# EAGLE design Wheatstone (EAGLE 9.6.2)
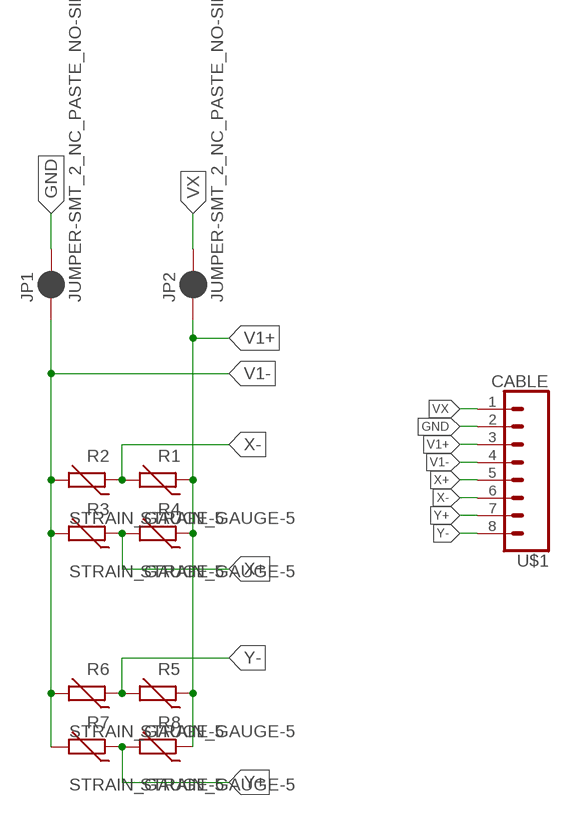
[diagram p0: schematic, sheet 1]

## Parts
JP1  JUMPER-SMT_2_NC_PASTE_NO-SILK  [SMT-JUMPER_2_NC_PASTE_NO-SILK]
JP2  JUMPER-SMT_2_NC_PASTE_NO-SILK  [SMT-JUMPER_2_NC_PASTE_NO-SILK]
R1  STRAIN_GAUGE-5  [STRAIN_GAUGE]
R2  STRAIN_GAUGE-5  [STRAIN_GAUGE]
R3  STRAIN_GAUGE-5  [STRAIN_GAUGE]
R4  STRAIN_GAUGE-5  [STRAIN_GAUGE]
R5  STRAIN_GAUGE-5  [STRAIN_GAUGE]
R6  STRAIN_GAUGE-5  [STRAIN_GAUGE]
R7  STRAIN_GAUGE-5  [STRAIN_GAUGE]
R8  STRAIN_GAUGE-5  [STRAIN_GAUGE]
U$1  CABLE  [CABLE]

## Nets
GND: JP1.2 U$1.2
V1+: JP2.1 R1.1 R4.1 R5.1 R8.1 U$1.3
V1-: JP1.1 R2.2 R3.2 R6.2 R7.2 U$1.4
VX: JP2.2 U$1.1
X+: R3.1 R4.2 U$1.5
X-: R1.2 R2.1 U$1.6
Y+: R7.1 R8.2 U$1.7
Y-: R5.2 R6.1 U$1.8

## Library data of the parts
JP1 JP2 = SparkFun-Jumpers:JUMPER-SMT_2_NC_PASTE: Normally closed solder jumper This jumper has an aperture in the stencil to allow solder paste to bridge the split in the wire so it's normally closed (NC). Wick off the solder to open the connection. Reapply solder to reclose the connection.
R1-R8 = Wheatstone:STRAIN_GAUGE: Strain gauge
U$1 = Wheatstone:CABLE

## Board
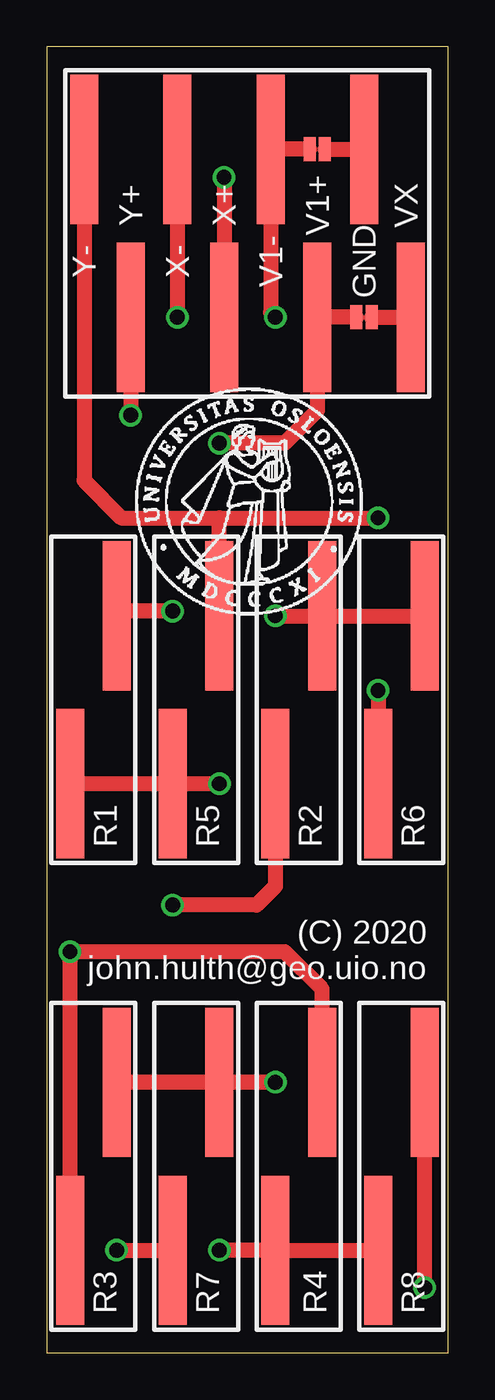
[diagram p1: board, top side]
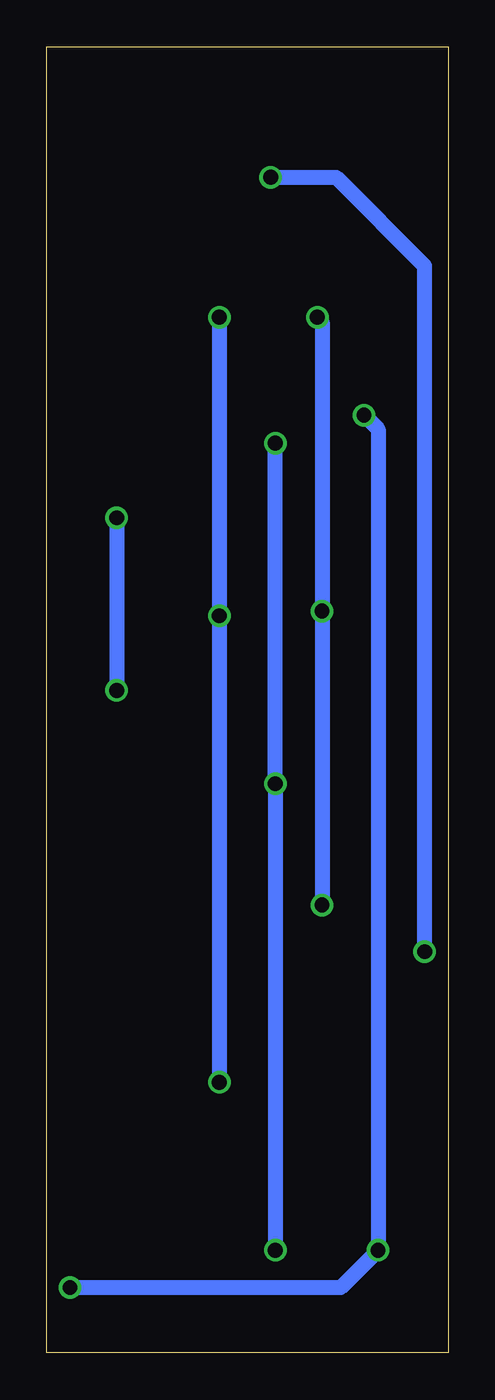
[diagram p2: board, bottom side, seen from below]

Size 21.5 x 70 mm. Coordinates in mm from the lower left corner, seen from the top.
Outline: 0,0 21.5,0 21.5,70 0,70 0,0
Copper layers (1*16): Top 0.018mm / dielectric 1.55mm / Bottom 0.018mm
Design rules "eC_2Layer_PClass6_BaseCopperO18_eCDefault": minimum track width 0.15mm, minimum drill 0.35mm, track to track 0.15mm, track to pad 0.15mm, pad to pad 0.15mm, via to via 0.15mm, smd to smd 0mil, copper to edge 0.25mm, drill to drill 0.35mm, minimum pad ring 0.175mm, minimum via ring 0.125mm, stop-mask expansion 0mil, vias tented up to drill 0.45mm, thermal gap 0.2mm

### Footprints (pad centres in the part's own frame; a part is rotated, then mirrored left to right if it is on the bottom)
SMT-JUMPER_2_NC_PASTE_NO-SILK = smd 0.635 x 1.27: 1 -0.406,0; 2 0.406,0
STRAIN_GAUGE = smd 1.5 x 8: 1 -1.25,-4.5; 2 1.25,4.5
CABLE = smd 1.5 x 8: 1 -8.75,4.5; 2 -6.25,-4.5; 3 -3.75,4.5; 4 -1.25,-4.5; 5 1.25,4.5; 6 3.75,-4.5; 7 6.25,4.5; 8 8.75,-4.5

### Placement (x,y rotation side)
JP1  14.5,64.5 0 top
JP2  17,55.5 0 top
R1  2.5,35 0 top
R2  13.5,35 0 top
R3  2.5,10 0 top
R4  13.5,10 0 top
R5  8,35 0 top
R6  19,35 0 top
R7  8,10 0 top
R8  19,10 0 top
U$1  10.75,60 180 top
U$3  [UIO-LOGO-BL]  4.51,39.29 0 top

### Tracks (layer width: path | path; a pad name or v marks a point on that pad's centre or on a via)
GND
  Top 0.8: JP1.2 U$1.2
V1+  (via drill 0.8)
  Top 0.8: JP2.1 U$1.3 14.5,50.5 12.75,48.75 v9.25,48.75 | v9.25,5.5 R4.1 R8.1 | v9.25,30.5 R5.1 R1.1
  Bottom 0.8: v9.25,5.5 v9.25,30.5 v9.25,48.75
V1-  (via drill 0.8)
  Top 0.8: JP1.1 U$1.4 12,55.75 v12.25,55.5 | v12.25,39.5 R2.2 R6.2 | v12.25,14.5 R7.2 R3.2
  Bottom 0.8: v12.25,55.5 v12.25,39.5 v12.25,14.5
VX
  Top 0.8: JP2.2 U$1.1
X+  (via drill 0.8)
  Top 0.8: R3.1 v1.25,21.5 12.75,21.5 14.75,19.5 R4.2 | v9.5,63 U$1.5
  Bottom 0.8: v1.25,21.5 1.25,58.25 6,63 v9.5,63
X-  (via drill 0.8)
  Top 0.8: R1.2 3.75,39.25 4.25,39.75 v6.75,39.75 | U$1.6 v7,55.5 | v6.75,24 11.25,24 12.25,25 R2.1
  Bottom 0.8: v7,55.5 6.75,55.25 v6.75,39.75 v6.75,24
Y+  (via drill 0.8)
  Top 0.8: U$1.7 v4.5,50.25 | v3.75,5.5 R7.1 | v20.25,3.5 R8.2
  Bottom 0.8: v4.5,50.25 3.75,49.5 v3.75,5.5 5.75,3.5 v20.25,3.5
Y-  (via drill 0.8)
  Top 0.8: 9.25,44.75 4,44.75 2,46.75 U$1.8 | 9.25,44.75 v17.75,44.75 | R5.2 9.25,44.75 | v17.75,35.5 R6.1
  Bottom 0.8: v17.75,44.75 v17.75,35.5

### Text on the board
tPlace: (C) 2020 / john.hulth@geo.uio.no
tNames: Y+ | X+ | V1+ | VX | Y- | X- | V1- | GND